# EAGLE schematic SmartWaterBottle (EAGLE 9.6.2)
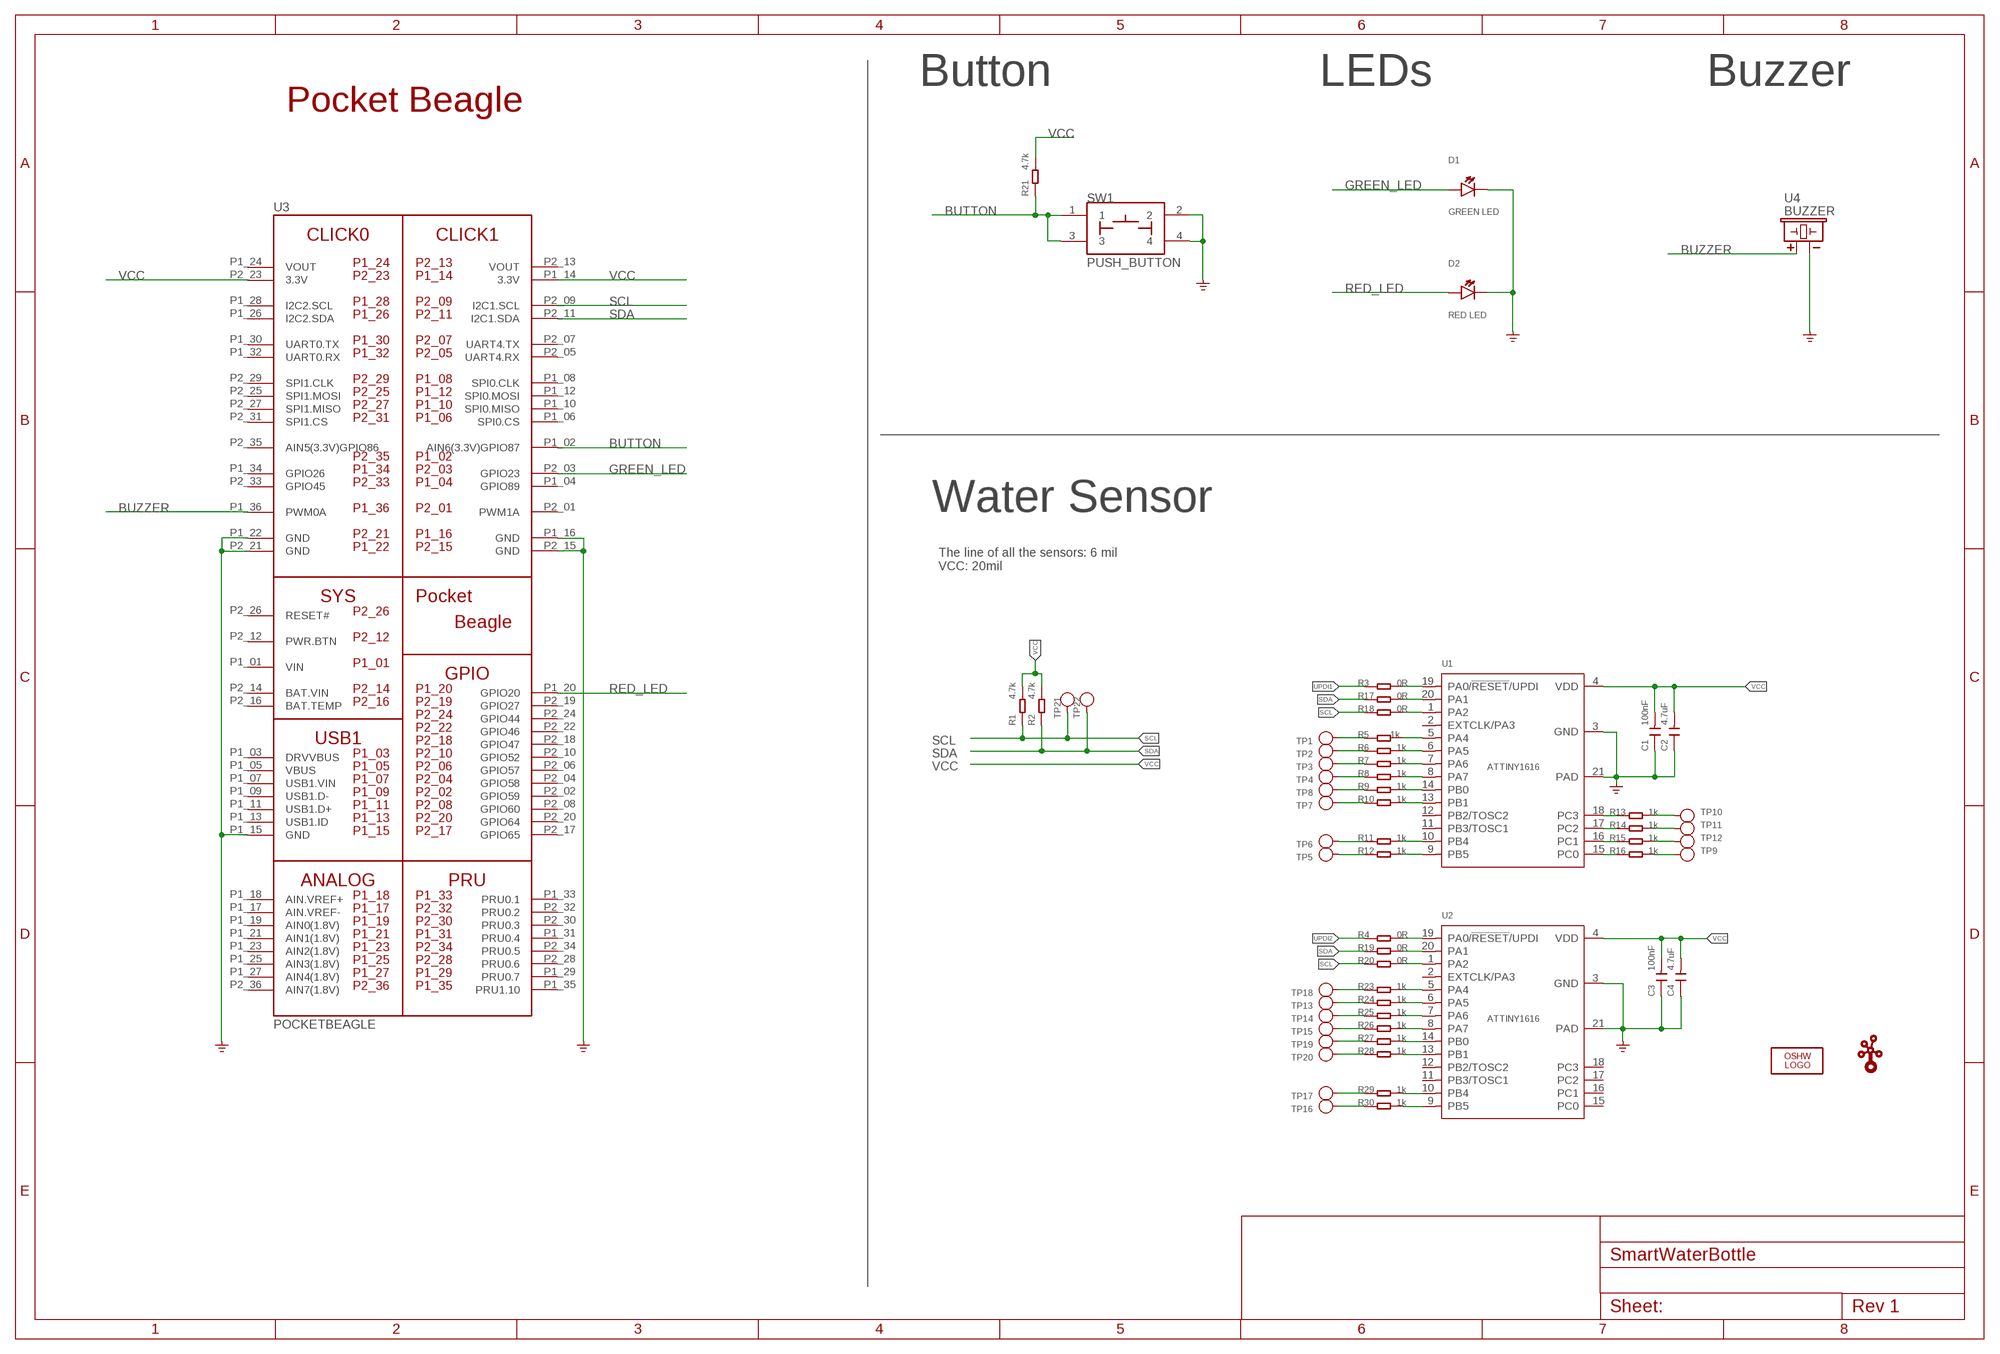
[diagram p0: schematic, sheet 1]

## Parts
C1  100nF  CAP-0402  [C0402]
C2  4.7uF  CAP-0402  [C0402]
C3  100nF  CAP-0402  [C0402]
C4  4.7uF  CAP-0402  [C0402]
D1  GREEN LED  LED  [EIA-STD]
D2  RED LED  LED  [EIA-STD]
LOGO2  LOGO-OSHW-FILLX0200-NT  [OSHW_FILLX200_NOTEXT]
R1  4.7k  RES-0402  [R0402]
R2  4.7k  RES-0402  [R0402]
R3  0R  RES-0402  [R0402]
R4  0R  RES-0402  [R0402]
R5  1k  RES-0402  [R0402]
R6  1k  RES-0402  [R0402]
R7  1k  RES-0402  [R0402]
R8  1k  RES-0402  [R0402]
R9  1k  RES-0402  [R0402]
R10  1k  RES-0402  [R0402]
R11  1k  RES-0402  [R0402]
R12  1k  RES-0402  [R0402]
R13  1k  RES-0402  [R0402]
R14  1k  RES-0402  [R0402]
R15  1k  RES-0402  [R0402]
R16  1k  RES-0402  [R0402]
R17  0R  RES-0402  [R0402]
R18  0R  RES-0402  [R0402]
R19  0R  RES-0402  [R0402]
R20  0R  RES-0402  [R0402]
R21  4.7k  RES-0402  [R0402]
R23  1k  RES-0402  [R0402]
R24  1k  RES-0402  [R0402]
R25  1k  RES-0402  [R0402]
R26  1k  RES-0402  [R0402]
R27  1k  RES-0402  [R0402]
R28  1k  RES-0402  [R0402]
R29  1k  RES-0402  [R0402]
R30  1k  RES-0402  [R0402]
SW1  PUSH_BUTTON  [BUTTON_12.5MM]
TP1  senser  TEST-POINTNOSTOP  [TP-80X40MIL-NOSTOP]
TP2  senser  TEST-POINTNOSTOP  [TP-80X40MIL-NOSTOP]
TP3  senser  TEST-POINTNOSTOP  [TP-80X40MIL-NOSTOP]
TP4  senser  TEST-POINTNOSTOP  [TP-80X40MIL-NOSTOP]
TP5  senser  TEST-POINTNOSTOP  [TP-80X40MIL-NOSTOP]
TP6  senser  TEST-POINTNOSTOP  [TP-80X40MIL-NOSTOP]
TP7  senser  TEST-POINTNOSTOP  [TP-80X40MIL-NOSTOP]
TP8  senser  TEST-POINTNOSTOP  [TP-80X40MIL-NOSTOP]
TP9  senser  TEST-POINTNOSTOP  [TP-80X40MIL-NOSTOP]
TP10  senser  TEST-POINTNOSTOP  [TP-80X40MIL-NOSTOP]
TP11  senser  TEST-POINTNOSTOP  [TP-80X40MIL-NOSTOP]
TP12  senser  TEST-POINTNOSTOP  [TP-80X40MIL-NOSTOP]
TP13  senser  TEST-POINTNOSTOP  [TP-80X40MIL-NOSTOP]
TP14  senser  TEST-POINTNOSTOP  [TP-80X40MIL-NOSTOP]
TP15  senser  TEST-POINTNOSTOP  [TP-80X40MIL-NOSTOP]
TP16  senser  TEST-POINTNOSTOP  [TP-80X40MIL-NOSTOP]
TP17  senser  TEST-POINTNOSTOP  [TP-80X40MIL-NOSTOP]
TP18  senser  TEST-POINTNOSTOP  [TP-80X40MIL-NOSTOP]
TP19  senser  TEST-POINTNOSTOP  [TP-80X40MIL-NOSTOP]
TP20  senser  TEST-POINTNOSTOP  [TP-80X40MIL-NOSTOP]
TP21  test  TEST-POINT'4545'  [TP-D45MIL]
TP22  test  TEST-POINT'4545'  [TP-D45MIL]
U1  ATTINY1616  MCU-ATTINY1616  [VQFN20-0.4-3X3MM]
U2  ATTINY1616  MCU-ATTINY1616  [VQFN20-0.4-3X3MM]
U3  POCKETBEAGLE  [POCKETBEAGLE]
U4  BUZZER  [BUZZER_6.5MM]
U$2  LOGO-GROVE  [GROVE-SILK-BIG]

## Nets
BUTTON: R21.1 SW1.1 SW1.3 U3.P1_02(AIN6(3.3V)GPIO87)
BUZZER: U3.P1_36(PWM0A) U4.+
GND: C1.1 C2.1 C3.1 C4.1 D1.CATHODE D2.CATHODE SW1.2 SW1.4 U1.3(GND) U1.21(PAD) U2.3(GND) U2.21(PAD) U3.P1_15(GND) U3.P1_16(GND) U3.P1_22(GND) U3.P2_15(GND) U3.P2_21(GND) U4.- ; supply symbol labelled GND_POWER
GREEN_LED: D1.ANODE U3.P2_03(GPIO23)
N$1: R3.2 U1.19(PA0/!RESET!/UPDI)
N$2: R4.2 U2.19(PA0/!RESET!/UPDI)
N$3: R17.2 U1.20(PA1)
N$4: R18.2 U1.1(PA2)
N$5: R19.2 U2.20(PA1)
N$6: R20.2 U2.1(PA2)
N$7: R23.1 TP18.P$1(T)
N$8: R29.1 TP17.P$1(T)
N$9: R30.2 U2.9(PB5)
N$10: R29.2 U2.10(PB4)
N$11: R28.2 U2.13(PB1)
N$12: R27.2 U2.14(PB0)
N$13: R26.2 U2.8(PA7)
N$14: R25.2 U2.7(PA6)
N$15: R24.2 U2.6(PA5)
N$16: R23.2 U2.5(PA4)
N$17: R28.1 TP20.P$1(T)
N$18: R27.1 TP19.P$1(T)
N$19: R5.2 U1.5(PA4)
N$20: R6.2 U1.6(PA5)
N$21: R7.2 U1.7(PA6)
N$22: R8.2 U1.8(PA7)
N$23: R9.2 U1.14(PB0)
N$24: R10.2 U1.13(PB1)
N$26: R25.1 TP14.P$1(T)
N$27: R11.2 U1.10(PB4)
N$28: R12.2 U1.9(PB5)
N$29: R13.1 U1.18(PC3)
N$30: R14.1 U1.17(PC2)
N$31: R15.1 U1.16(PC1)
N$32: R16.1 U1.15(PC0)
N$33: R11.1 TP6.P$1(T)
N$34: R12.1 TP5.P$1(T)
N$35: R26.1 TP15.P$1(T)
N$36: R30.1 TP16.P$1(T)
N$37: R10.1 TP7.P$1(T)
N$38: R9.1 TP8.P$1(T)
N$39: R24.1 TP13.P$1(T)
N$40: R13.2 TP10.P$1(T)
N$41: R14.2 TP11.P$1(T)
N$42: R15.2 TP12.P$1(T)
N$43: R5.1 TP1.P$1(T)
N$44: R6.1 TP2.P$1(T)
N$45: R7.1 TP3.P$1(T)
N$46: R8.1 TP4.P$1(T)
N$50: R16.2 TP9.P$1(T)
RED_LED: D2.ANODE U3.P1_20(GPIO20)
SCL: R1.1 R18.1 R20.1 TP21.T U3.P2_09(I2C1.SCL)
SDA: R2.1 R17.1 R19.1 TP22.T U3.P2_11(I2C1.SDA)
UPDI1: R3.1
UPDI2: R4.1
VCC: C1.2 C2.2 C3.2 C4.2 R1.2 R2.2 R21.2 U1.4(VDD) U2.4(VDD) U3.P1_14(3.3V) U3.P2_23(3.3V)
Unconnected: U1.2(EXTCLK/PA3) U1.11(PB3/TOSC1) U1.12(PB2/TOSC2) U2.2(EXTCLK/PA3) U2.11(PB3/TOSC1) U2.12(PB2/TOSC2) U2.15(PC0) U2.16(PC1) U2.17(PC2) U2.18(PC3) U3.P1_03(DRVVBUS) U3.P1_04(GPIO89) U3.P1_05(VBUS) U3.P1_06(SPI0.CS) U3.P1_07(USB1.VIN) U3.P1_08(SPI0.CLK) U3.P1_09(USB1.D-) U3.P1_10(SPI0.MISO) U3.P1_11(USB1.D+) U3.P1_12(SPI0.MOSI) U3.P1_13(USB1.ID) U3.P1_17(AIN.VREF-) U3.P1_18(AIN.VREF+) U3.P1_19(AIN0(1.8V)) U3.P1_21(AIN1(1.8V)) U3.P1_23(AIN2(1.8V)) U3.P1_25(AIN3(1.8V)) U3.P1_26(I2C2.SDA) U3.P1_27(AIN4(1.8V)) U3.P1_28(I2C2.SCL) U3.P1_29(PRU0.7) U3.P1_30(UART0.TX) U3.P1_31(PRU0.4) U3.P1_32(UART0.RX) U3.P1_33(PRU0.1) U3.P1_34(GPIO26) U3.P1_35(PRU1.10) U3.P2_01(PWM1A) U3.P2_02(GPIO59) U3.P2_04(GPIO58) U3.P2_05(UART4.RX) U3.P2_06(GPIO57) U3.P2_07(UART4.TX) U3.P2_08(GPIO60) U3.P2_10(GPIO52) U3.P2_12(PWR.BTN) U3.P2_16(BAT.TEMP) U3.P2_17(GPIO65) U3.P2_18(GPIO47) U3.P2_19(GPIO27) U3.P2_20(GPIO64) U3.P2_22(GPIO46) U3.P2_24(GPIO44) U3.P2_25(SPI1.MOSI) U3.P2_26(RESET#) U3.P2_27(SPI1.MISO) U3.P2_28(PRU0.6) U3.P2_29(SPI1.CLK) U3.P2_30(PRU0.3) U3.P2_31(SPI1.CS) U3.P2_32(PRU0.2) U3.P2_33(GPIO45) U3.P2_34(PRU0.5) U3.P2_35(AIN5(3.3V)GPIO86) U3.P2_36(AIN7(1.8V))

## Notes on the sheet
- Button | LEDs | Buzzer
- Pocket Beagle
- Water Sensor
- The line of all the sensors: 6 mil
  VCC: 20mil

## Power pins joined to a net without a drawn wire
BAT.VIN: U3.P2_14(BAT.VIN)
VIN: U3.P1_01(VIN)
VOUT: U3.P1_24(VOUT) U3.P2_13(VOUT)

## Library data of the parts
C1-C4 = Discrete-new:CAP: Ceramic Capacitors
D1 D2 = combo_lock:LED: EIA-STD LED, LTST-C191TBKT
LOGO2 = logo:LOGO-OSHW-FILL; PARTNO: DNP
R1-R21 R23-R30 = Discrete-new:RES
SW1 = combo_lock:PUSH_BUTTON
TP1-TP20 = Discrete-new:TEST-POINT
TP21 TP22 = Discrete-new:TEST-POINT; PARTNO: DNP
U1 U2 = IC-new:MCU-ATTINY1616
U3 = combo_lock:POCKETBEAGLE
U4 = combo_lock:BUZZER: CEM-1203 Buzzer
U$2 = logo:LOGO-GROVE; PARTNO: DNP